# Altium project Timer_Clock_TOP.PrjPcb
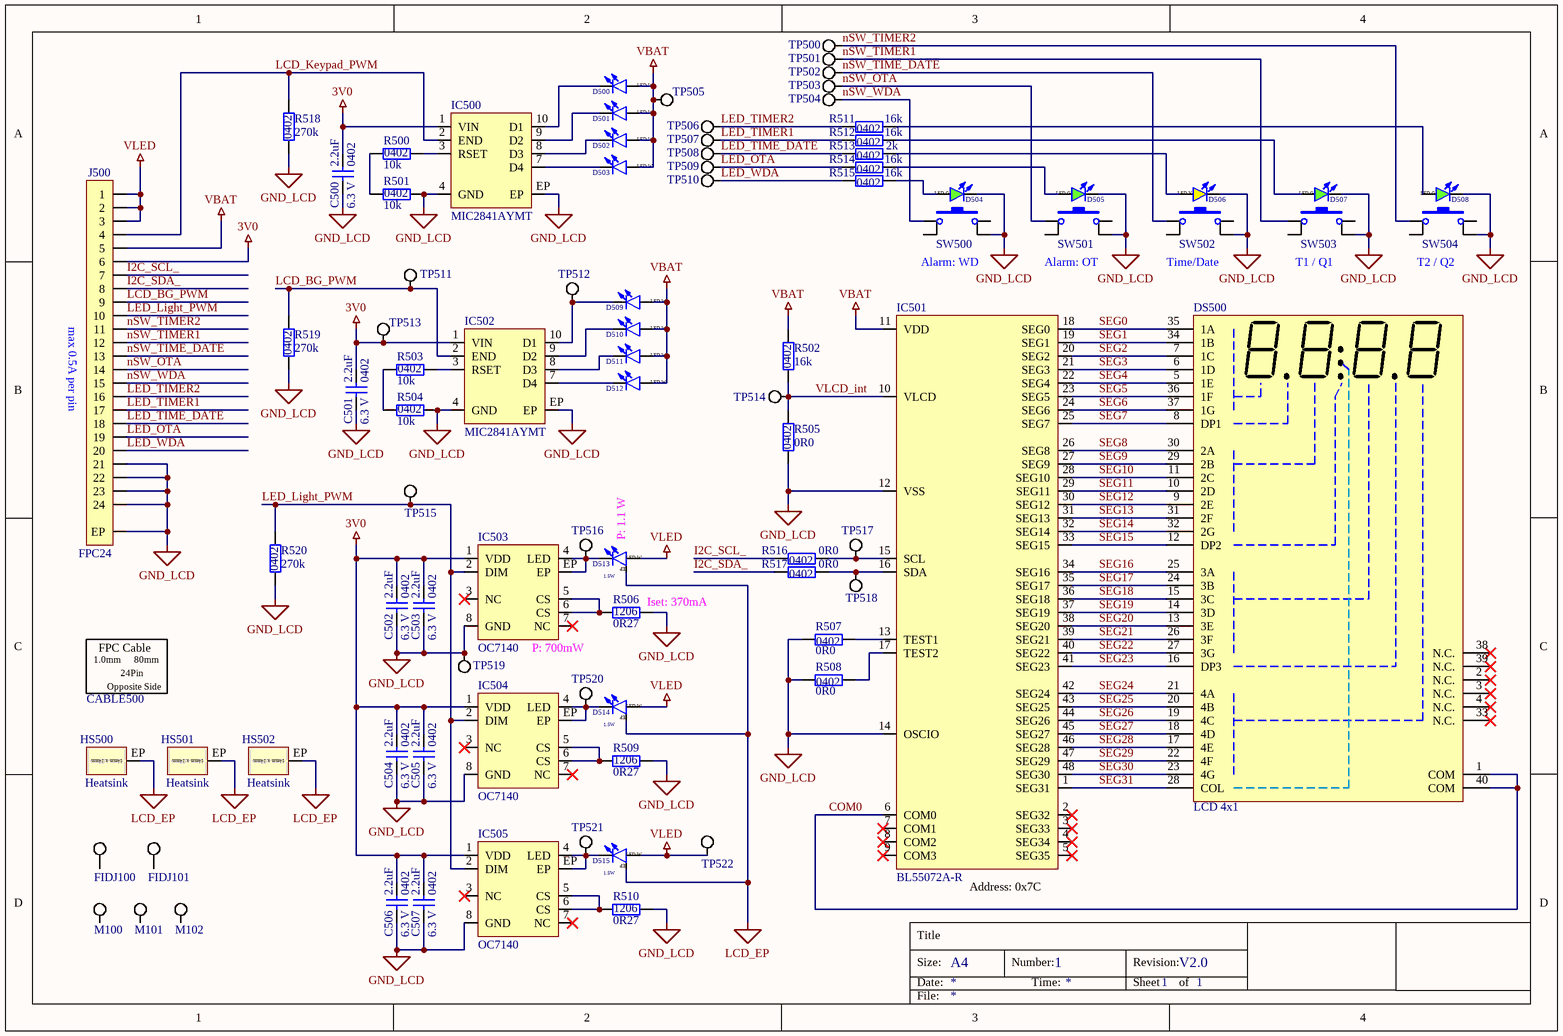
[diagram p0: LCD.SchDoc]
ProjectName: Alarm Clock - PCB TOP; Revision: V2.0; Signature1: Marius Tetard; Signature2: 2022-06 / Freiburg
1 sheet, 90 parts. Net scope: global (net labels, ports and power ports of the same name join across sheets).

## Sheet LCD.SchDoc: =ProjectName
size A4; Organization: Marius Tetard; Address1: 2022-06 / Freiburg; DocumentNumber: 1; Revision: V2.0; SheetNumber: 1; SheetTotal: 1

### Parts
C500  Capacitance: 2.2uF  Footprint: 0402  Voltage: 6.3 V  [C_0402]  (hidden comment: C 2.2uF 0402 6.3V)
C501  Capacitance: 2.2uF  Footprint: 0402  Voltage: 6.3 V  [C_0402]  (hidden comment: C 2.2uF 0402 6.3V)
C502  Capacitance: 2.2uF  Footprint: 0402  Voltage: 6.3 V  [C_0402]  (hidden comment: C 2.2uF 0402 6.3V)
C503  Capacitance: 2.2uF  Footprint: 0402  Voltage: 6.3 V  [C_0402]  (hidden comment: C 2.2uF 0402 6.3V)
C504  Capacitance: 2.2uF  Footprint: 0402  Voltage: 6.3 V  [C_0402]  (hidden comment: C 2.2uF 0402 6.3V)
C505  Capacitance: 2.2uF  Footprint: 0402  Voltage: 6.3 V  [C_0402]  (hidden comment: C 2.2uF 0402 6.3V)
C506  Capacitance: 2.2uF  Footprint: 0402  Voltage: 6.3 V  [C_0402]  (hidden comment: C 2.2uF 0402 6.3V)
C507  Capacitance: 2.2uF  Footprint: 0402  Voltage: 6.3 V  [C_0402]  (hidden comment: C 2.2uF 0402 6.3V)
CABLE500  Pitch: 1.0mm  Length: 80mm  Mode: Opposite Side  NoOfPins: 24Pin  (hidden comment: FPC24p80mm)  (mechanical)
D500  LED W  [LED_99-218UMC_side]
D501  LED W  [LED_99-218UMC_side]
D502  LED W  [LED_99-218UMC_side]
D503  LED W  [LED_99-218UMC_side]
D504  LED G  [LED_0603]
D505  LED G  [LED_0603]
D506  LED Y  [LED_0603]
D507  LED G  [LED_0603]
D508  LED G  [LED_0603]
D509  LED W  [LED_99-218UMC_side]
D510  LED W  [LED_99-218UMC_side]
D511  LED W  [LED_99-218UMC_side]
D512  LED W  [LED_99-218UMC_side]
D513  LED W  Power: 1.5W  [LED_3.3x3.3_ThermalVia]
D514  LED W  Power: 1.5W  [LED_3.3x3.3_ThermalVia]
D515  LED W  Power: 1.5W  [LED_3.3x3.3_ThermalVia]
DS500  LCD 4x1  [DISPL_7SEG_4]
FIDJ100  Fiducial  [FIDJ_1mm]  (value not drawn)  (net tie, no BOM)
FIDJ101  Fiducial  [FIDJ_1mm]  (value not drawn)  (net tie, no BOM)
HS500  Heatsink  [Heatsink_Alphacool17425]
HS501  Heatsink  [Heatsink_Alphacool17425]
HS502  Heatsink  [Heatsink_Alphacool17425]
IC500  MIC2841AYMT  [UFDFN-10]
IC501  BL55072A-R  [TSSOP-48]
IC502  MIC2841AYMT  [UFDFN-10]
IC503  OC7140  [SOIC-8-EP]
IC504  OC7140  [SOIC-8-EP]
IC505  OC7140  [SOIC-8-EP]
J500  FPC24  [J_FPC_522712479]
M100  M3x8  [SCREW_M3x8_nP_FH]  (value not drawn)  (net tie, no BOM)
M101  M3x8  [SCREW_M3x8_nP_FH]  (value not drawn)  (net tie, no BOM)
M102  M3x8  [SCREW_M3x8_nP_FH]  (value not drawn)  (net tie, no BOM)
R500  Resistance: 10k  Footprint: 0402  [R_0402]  (hidden comment: R 10k 0402)
R501  Resistance: 10k  Footprint: 0402  [R_0402]  (hidden comment: R 10k 0402)
R502  Resistance: 16k  Footprint: 0402  [R_0402]  (hidden comment: R 16k 0402)
R503  Resistance: 10k  Footprint: 0402  [R_0402]  (hidden comment: R 10k 0402)
R504  Resistance: 10k  Footprint: 0402  [R_0402]  (hidden comment: R 10k 0402)
R505  Resistance: 0R0  Footprint: 0402  [R_0402]  (hidden comment: R 0R0 0402)
R506  Resistance: 0R27  Footprint: 1206  [R_1206]  (hidden comment: R 0R27 1206)
R507  Resistance: 0R0  Footprint: 0402  [R_0402]  (hidden comment: R 0R0 0402)
R508  Resistance: 0R0  Footprint: 0402  [R_0402]  (hidden comment: R 0R0 0402)
R509  Resistance: 0R27  Footprint: 1206  [R_1206]  (hidden comment: R 0R27 1206)
R510  Resistance: 0R27  Footprint: 1206  [R_1206]  (hidden comment: R 0R27 1206)
R511  Resistance: 16k  Footprint: 0402  [R_0402]  (hidden comment: R 16k 0402)
R512  Resistance: 16k  Footprint: 0402  [R_0402]  (hidden comment: R 16k 0402)
R513  Resistance: 2k  Footprint: 0402  [R_0402]  (hidden comment: R 2k 0402)
R514  Resistance: 16k  Footprint: 0402  [R_0402]  (hidden comment: R 16k 0402)
R515  Resistance: 16k  Footprint: 0402  [R_0402]  (hidden comment: R 16k 0402)
R516  Resistance: 0R0  Footprint: 0402  [R_0402]  (hidden comment: R 0R0 0402)
R517  Resistance: 0R0  Footprint: 0402  [R_0402]  (hidden comment: R 0R0 0402)
R518  Resistance: 270k  Footprint: 0402  [R_0402]  (hidden comment: R 270k 0402)
R519  Resistance: 270k  Footprint: 0402  [R_0402]  (hidden comment: R 270k 0402)
R520  Resistance: 270k  Footprint: 0402  [R_0402]  (hidden comment: R 270k 0402)
SW500  SW  [SW_BRIGHT_6.1x6.1]  (value not drawn)
SW501  SW  [SW_BRIGHT_6.1x6.1]  (value not drawn)
SW502  SW  [SW_BRIGHT_6.1x6.1]  (value not drawn)
SW503  SW  [SW_BRIGHT_6.1x6.1]  (value not drawn)
SW504  SW  [SW_BRIGHT_6.1x6.1]  (value not drawn)
TP500  TP  [TP_1mm]  (value not drawn)  (net tie, no BOM)
TP501  TP  [TP_1mm]  (value not drawn)  (net tie, no BOM)
TP502  TP  [TP_1mm]  (value not drawn)  (net tie, no BOM)
TP503  TP  [TP_1mm]  (value not drawn)  (net tie, no BOM)
TP504  TP  [TP_1mm]  (value not drawn)  (net tie, no BOM)
TP505  TP  [TP_1mm]  (value not drawn)  (net tie, no BOM)
TP506  TP  [TP_1mm]  (value not drawn)  (net tie, no BOM)
TP507  TP  [TP_1mm]  (value not drawn)  (net tie, no BOM)
TP508  TP  [TP_1mm]  (value not drawn)  (net tie, no BOM)
TP509  TP  [TP_1mm]  (value not drawn)  (net tie, no BOM)
TP510  TP  [TP_1mm]  (value not drawn)  (net tie, no BOM)
TP511  TP  [TP_1mm]  (value not drawn)  (net tie, no BOM)
TP512  TP  [TP_1mm]  (value not drawn)  (net tie, no BOM)
TP513  TP  [TP_1mm]  (value not drawn)  (net tie, no BOM)
TP514  TP  [TP_1mm]  (value not drawn)  (net tie, no BOM)
TP515  TP  [TP_1mm]  (value not drawn)  (net tie, no BOM)
TP516  TP  [TP_1mm]  (value not drawn)  (net tie, no BOM)
TP517  TP  [TP_1mm]  (value not drawn)  (net tie, no BOM)
TP518  TP  [TP_1mm]  (value not drawn)  (net tie, no BOM)
TP519  TP  [TP_1mm]  (value not drawn)  (net tie, no BOM)
TP520  TP  [TP_1mm]  (value not drawn)  (net tie, no BOM)
TP521  TP  [TP_1mm]  (value not drawn)  (net tie, no BOM)
TP522  TP  [TP_1mm]  (value not drawn)  (net tie, no BOM)

### Nets
3V0: C500.2 C501.2 C502.2 C503.2 C504.2 C505.2 C506.2 C507.2 IC500.1(VIN) IC502.1(VIN) IC503.1(VDD) IC504.1(VDD) IC505.1(VDD) J500.6 TP513.1(TP)
GND_LCD: C500.1 C501.1 C502.1 C503.1 C504.1 C505.1 C506.1 C507.1 D504.K D505.K D506.K D507.K D508.K IC500.4(GND) IC500.EP IC501.12(VSS) IC501.14(OSCIO) IC502.4(GND) IC502.EP IC503.8(GND) IC504.8(GND) IC505.8(GND) J500.21 J500.22 J500.23 J500.24 J500.EP R501.1 R504.1 R505.1 R506.2 R507.2 R508.2 R509.2 R510.2 R518.1 R519.1 R520.1 SW500.4 SW501.4 SW502.4 SW503.4 SW504.4 TP519.1(TP)
LCD_EP: D513.EP D514.EP D515.EP HS500.EP HS501.EP HS502.EP
VBAT: D500.2(A) D501.2(A) D502.2(A) D503.2(A) D509.2(A) D510.2(A) D511.2(A) D512.2(A) IC501.11(VDD) J500.5 R502.2 TP505.1(TP)
VLED: D513.A D514.A D515.A J500.1 J500.2 J500.3 TP522.1(TP)
COM0: DS500.1(COM) DS500.40(COM) IC501.6(COM0)
I2C_SCL_: J500.7 R516.2
I2C_SDA_: J500.8 R517.2
LCD_BG_PWM: IC502.2(END) J500.9 R519.2 TP511.1(TP)
LCD_Keypad_PWM: IC500.2(END) J500.4 R518.2
LED_Light_PWM: IC503.2(DIM) IC504.2(DIM) IC505.2(DIM) J500.10 R520.2 TP515.1(TP)
LED_OTA: J500.19 R514.2 TP509.1(TP)
LED_TIME_DATE: J500.18 R513.2 TP508.1(TP)
LED_TIMER1: J500.17 R512.2 TP507.1(TP)
LED_TIMER2: J500.16 R511.2 TP506.1(TP)
LED_WDA: J500.20 R515.2 TP510.1(TP)
nSW_OTA: J500.14 SW501.1 TP503.1(TP)
nSW_TIME_DATE: J500.13 SW502.1 TP502.1(TP)
nSW_TIMER1: J500.12 SW503.1 TP501.1(TP)
nSW_TIMER2: J500.11 SW504.1 TP500.1(TP)
nSW_WDA: J500.15 SW500.1 TP504.1(TP)
SEG0: DS500.35(1A) IC501.18(SEG0)
SEG1: DS500.34(1B) IC501.19(SEG1)
SEG2: DS500.7(1C) IC501.20(SEG2)
SEG3: DS500.6(1D) IC501.21(SEG3)
SEG4: DS500.5(1E) IC501.22(SEG4)
SEG5: DS500.36(1F) IC501.23(SEG5)
SEG6: DS500.37(1G) IC501.24(SEG6)
SEG7: DS500.8(DP1) IC501.25(SEG7)
SEG8: DS500.30(2A) IC501.26(SEG8)
SEG9: DS500.29(2B) IC501.27(SEG9)
SEG10: DS500.11(2C) IC501.28(SEG10)
SEG11: DS500.10(2D) IC501.29(SEG11)
SEG12: DS500.9(2E) IC501.30(SEG12)
SEG13: DS500.31(2F) IC501.31(SEG13)
SEG14: DS500.32(2G) IC501.32(SEG14)
SEG15: DS500.12(DP2) IC501.33(SEG15)
SEG16: DS500.25(3A) IC501.34(SEG16)
SEG17: DS500.24(3B) IC501.35(SEG17)
SEG18: DS500.15(3C) IC501.36(SEG18)
SEG19: DS500.14(3D) IC501.37(SEG19)
SEG20: DS500.13(3E) IC501.38(SEG20)
SEG21: DS500.26(3F) IC501.39(SEG21)
SEG22: DS500.27(3G) IC501.40(SEG22)
SEG23: DS500.16(DP3) IC501.41(SEG23)
SEG24: DS500.21(4A) IC501.42(SEG24)
SEG25: DS500.20(4B) IC501.43(SEG25)
SEG26: DS500.19(4C) IC501.44(SEG26)
SEG27: DS500.18(4D) IC501.45(SEG27)
SEG28: DS500.17(4E) IC501.46(SEG28)
SEG29: DS500.22(4F) IC501.47(SEG29)
SEG30: DS500.23(4G) IC501.48(SEG30)
SEG31: DS500.28(COL) IC501.1(SEG31)
VLCD_int: IC501.10(VLCD) R502.1 R505.2 TP514.1(TP)
NetD500_1: D500.1(K) IC500.10(D1)
NetD501_1: D501.1(K) IC500.9(D2)
NetD502_1: D502.1(K) IC500.8(D3)
NetD503_1: D503.1(K) IC500.7(D4)
NetD504_A: D504.A R515.1
NetD505_A: D505.A R514.1
NetD506_A: D506.A R513.1
NetD507_A: D507.A R512.1
NetD508_A: D508.A R511.1
NetD509_1: D509.1(K) IC502.10(D1) TP512.1(TP)
NetD510_1: D510.1(K) IC502.9(D2)
NetD511_1: D511.1(K) IC502.8(D3)
NetD512_1: D512.1(K) IC502.7(D4)
NetD513_K: D513.K IC503.4(LED) IC503.EP TP516.1(TP)
NetD514_K: D514.K IC504.4(LED) IC504.EP TP520.1(TP)
NetD515_K: D515.K IC505.4(LED) IC505.EP TP521.1(TP)
NetIC500_3: IC500.3(RSET) R500.1
NetIC501_13: IC501.13(TEST1) R507.1
NetIC501_15: IC501.15(SCL) R516.1 TP517.1(TP)
NetIC501_16: IC501.16(SDA) R517.1 TP518.1(TP)
NetIC501_17: IC501.17(TEST2) R508.1
NetIC502_3: IC502.3(RSET) R503.1
NetIC503_5: IC503.5(CS) IC503.6(CS) R506.1
NetIC504_5: IC504.5(CS) IC504.6(CS) R509.1
NetIC505_5: IC505.5(CS) IC505.6(CS) R510.1
NetR500_2: R500.2 R501.2
NetR503_2: R503.2 R504.2

Not connected (* = marked no-connect by the designer): DS500 2(N.C.)* 3(N.C.)* 4(N.C.)* 33(N.C.)* 38(N.C.)* 39(N.C.)*; FIDJ100 1; FIDJ101 1; IC501 2(SEG32)* 3(SEG33)* 4(SEG34)* 5(SEG35)* 7(COM1)* 8(COM2)* 9(COM3)*; IC503 3(NC)* 7(NC)*; IC504 3(NC)* 7(NC)*; IC505 3(NC)* 7(NC)*; SW500 2 3; SW501 2 3; SW502 2 3; SW503 2 3; SW504 2 3

### Notes on the sheet
- (near SW500) Alarm: WD
- (near SW501) Alarm: OT
- (near SW502) Time/Date
- (near SW503) T1 / Q1
- (near SW504) T2 / Q2
- (near J500) max 0.5A per pin
- (near D513) P: 1.1 W
- (near IC503) P: 700mW
- (near R506) Iset: 370mA
- (near IC501) Address: 0x7C
- Title
- Size:
- Date:
- A4
- Number:
- Time:
- Revision:
- Sheet
- of
- File:
- (in symbol CABLE_FPC24_80) FPC Cable
- (in symbol Heatsink_6.5x6.5) 14mm x 14mm

### Library data of the parts
C500-C507 = CAP_2.2uF_6V3_0402: CAP CER 2.2UF 6.3V X6T 0402; Manufacturer: Murata Electronics; Manufacturer Part Number: GRM155D80J225ME95D; Type: Capacitor; Supplier 1: Digi-Key; Supplier Part Number 1: 490-10450-1-ND
CABLE500 = CABLE_FPC24_80: FPC Cable 1mm Pitch 24Pin 80mm Opposite Sides; Manufacturer: LX; Manufacturer Part Number: C50299; Type: other; Supplier 1: LCSC; Supplier Part Number 1: C50299
D500-D503 D509-D512 = D_LED_White_s: LED WHITE SIDE SMD; Manufacturer: Everlight Elec; Manufacturer Part Number: 99-218UMC/1637CD/TR8-T; Type: Diode, LED; Supplier 1: LCSC; Supplier Part Number 1: C710226
D504 D505 D507 D508 = D_LED_Green_0603: LED GREEN DIFFUSED 0603 SMD; Manufacturer: OSRAM Opto Semiconductors Inc.; Manufacturer Part Number: LT Q39G-Q1OO-25-1; Type: Diode, LED; Supplier 1: Digi-Key; Supplier Part Number 1: 475-3442-1-ND
D506 = D_LED_Yellow_0603: LED YELLOW DIFFUSED; Manufacturer: Stanley Electric Co; Manufacturer Part Number: FKY1111C-TR; Type: Diode, LED; Supplier 1: Digi-Key; Supplier Part Number 1: 404-1273-1-ND
D513-D515 = D_LED_W_HP_3: LED XLAMP WARM WHT 2700K SMD; Manufacturer: CreeLED, Inc.; Manufacturer Part Number: XTEAWT-E0-0000-00000HEE8; Type: Diode, LED; Supplier 1: Digi-Key; Supplier Part Number 1: XTEAWT-E0-0000-00000HEE8TR-ND
DS500 = DISPL_7SEG_4x1: LCD MOD 4 DIG 4 X 1 REFLECTIVE; Manufacturer: Varitronix; Manufacturer Part Number: VI-402-DP-RC-S; Type: other, Display; Supplier 1: Digi-Key; Supplier Part Number 1: 153-1135-ND
FIDJ100 FIDJ101 = FIDJ_1mm: Fiducal 1mm
HS500-HS502 = Heatsink_6.5x6.5: Heatsink 6.5mm x 6.5mm; Manufacturer: Alphacool; Manufacturer Part Number: 17425; Type: other; Supplier 1: Amazon; Supplier Part Number 1: B077VQTB6Q
IC500 IC502 = IC_LED_cntr_MIC2841: IC LED DRIVER 4 CH; Manufacturer: Microchip Technology; Manufacturer Part Number: MIC2841AYMT-TR; Type: IC, Driver; Supplier 1: Mouser; Supplier Part Number 1: 998-MIC2841AYMTTR
IC501 = IC_LCD_cntr_BL55072A-R: IC LCD DRIVER 36SEG TSSOP-48; Manufacturer: BL(Shanghai Belling); Manufacturer Part Number: BL55072A-R; Type: IC, Driver; Supplier 1: LCSC; Supplier Part Number 1: C524044
IC503-IC505 = IC_LED_cntr_OC7140: IC LED DRIVER 1 CH 2A ESOP8; Manufacturer: OCX; Manufacturer Part Number: OC7140; Type: IC, Driver; Supplier 1: LCSC; Supplier Part Number 1: C842736
J500 = J_FPC24_DS: CONN FPC BOT 24 PIN 1mm Pitch; Manufacturer: MOLEX; Manufacturer Part Number: 522712479; Pitch: 1.0; Type: Connector; Supplier 1: LCSC; Supplier Part Number 1: C293627; Pins: 24
M100-M102 = SCREW_M3x8_nP_FH: Skrew M3x8 Not Plated Flathat
R500 R501 R503 R504 = R_10k_0402: RES 10K OHM 1% 1/16W 0402; Manufacturer: YAGEO; Manufacturer Part Number: RC0402FR-0710KL; Type: Resistor; Supplier 1: Digi-Key; Supplier Part Number 1: 311-10.0KLRCT-ND
R502 R511 R512 R514 R515 = R_16k_0402: RES 16K OHM 1% 1/16W 0402; Manufacturer: Stackpole Electronics Inc; Manufacturer Part Number: RMCF0402FT16K0; Type: Resistor; Supplier 1: Digi-Key; Supplier Part Number 1: RMCF0402FT16K0CT-ND
R505 R507 R508 R516 R517 = R_0R0_0402: RES 0 OHM JUMPER 1/16W 0402; Manufacturer: Stackpole Electronics Inc; Manufacturer Part Number: RMCF0402ZT0R00; Type: Resistor; Supplier 1: Digi-Key; Supplier Part Number 1: RMCF0402ZT0R00CT-ND
R506 R509 R510 = R_0R27_1206: RES 0.27 OHM 1% 1/3W 1206; Manufacturer: RALEC; Manufacturer Part Number: RTT06R270FTP; Type: Resistor; Supplier 1: LCSC; Supplier Part Number 1: C104939
R513 = R_2k_0402: RES 2K OHM 1% 1/16W 0402; Manufacturer: Stackpole Electronics Inc; Manufacturer Part Number: RMCF0402FT2K00; Type: Resistor; Supplier 1: Digi-Key; Supplier Part Number 1: RMCF0402FT2K00CT-ND
R518-R520 = R_270k_0402: RES 270K OHM 1% 1/16W 0402; Manufacturer: YAGEO; Manufacturer Part Number: RC0402FR-07270KL; Type: Resistor; Supplier 1: Digi-Key; Supplier Part Number 1: 311-270KLRCT-ND
SW500-SW504 = SW_TactileSW_V_2: SWITCH TACTILE SW-SMD; Manufacturer: BRIGHT; Manufacturer Part Number: TSA063G50-250; Type: other; Supplier 1: LCSC; Supplier Part Number 1: C294565
TP500-TP522 = TP_1mm: Test Point 1mm

## Assembly variants
Alarm Clock: not fitted R502